# EAGLE board sweet sixteen v24_3 (EAGLE 7.2.0)
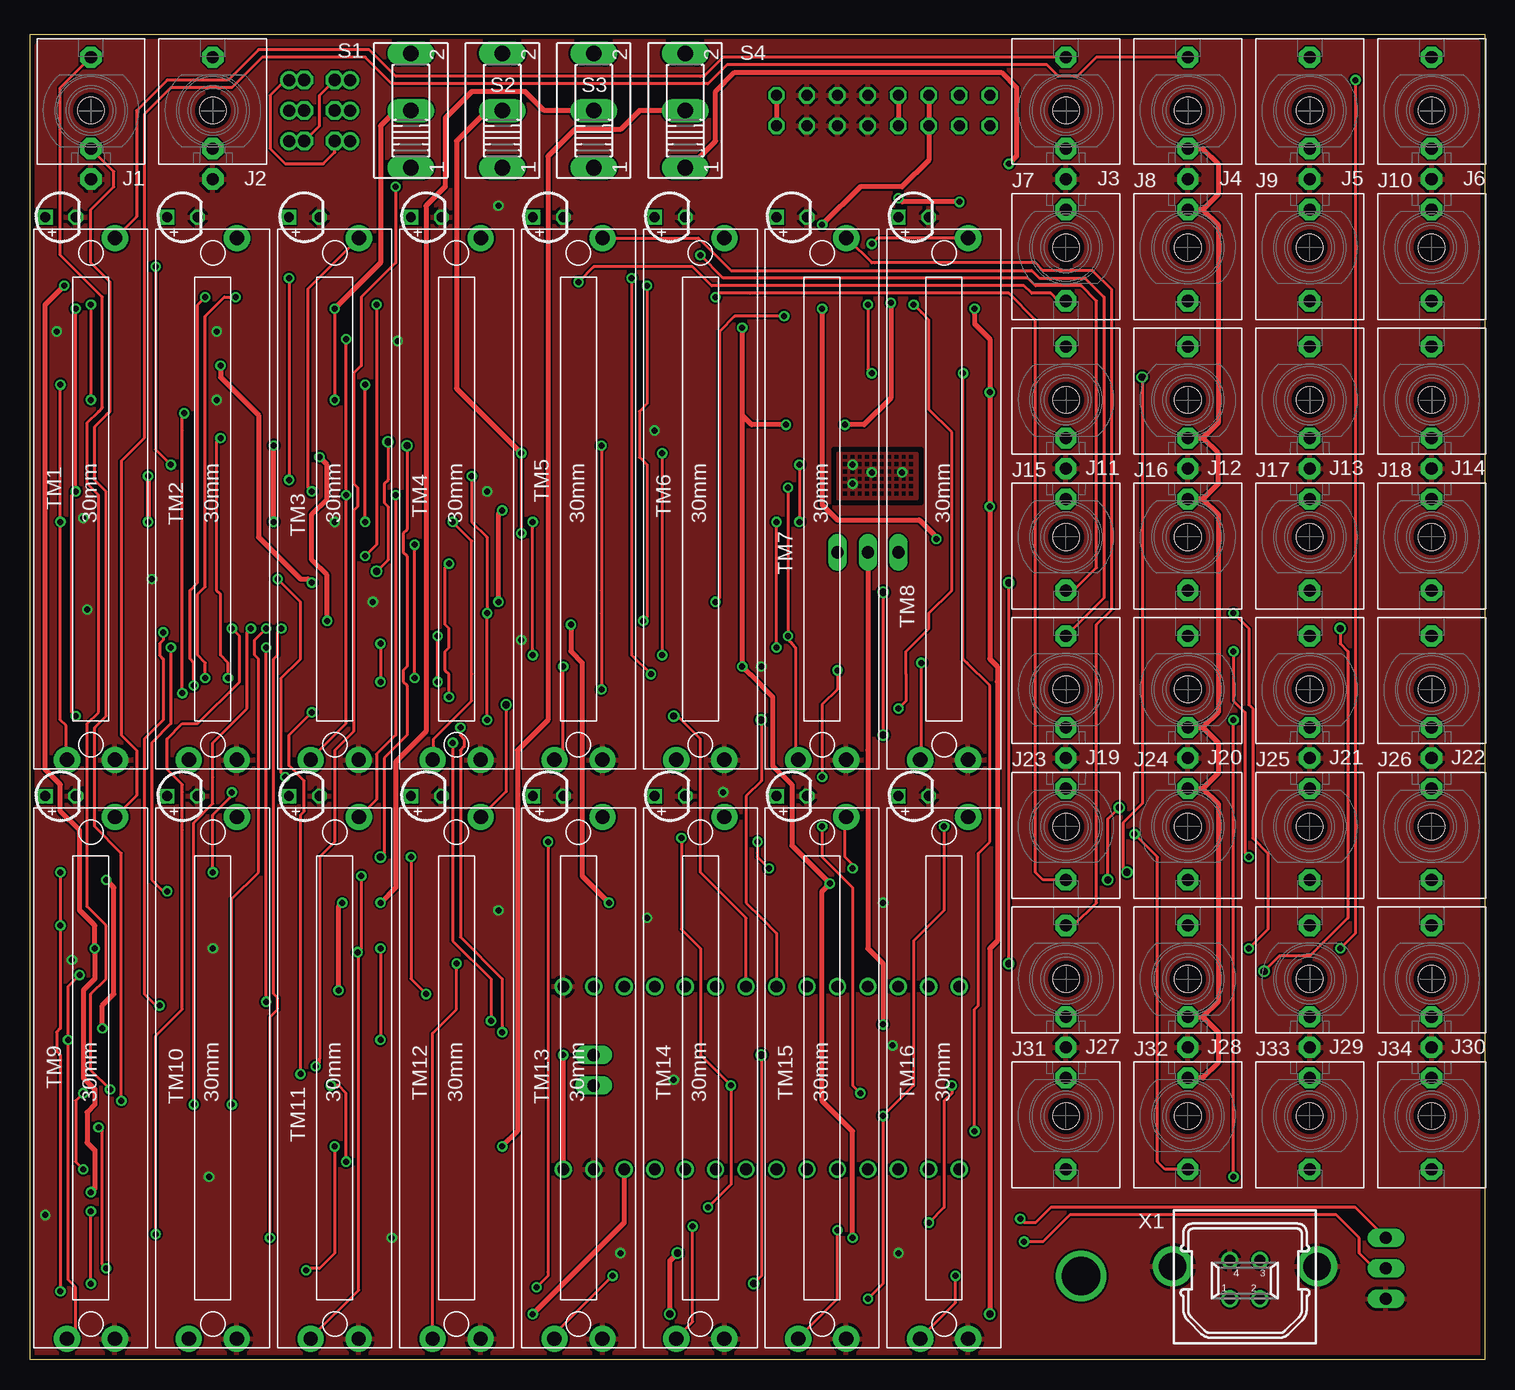
[diagram p3: board, top side]
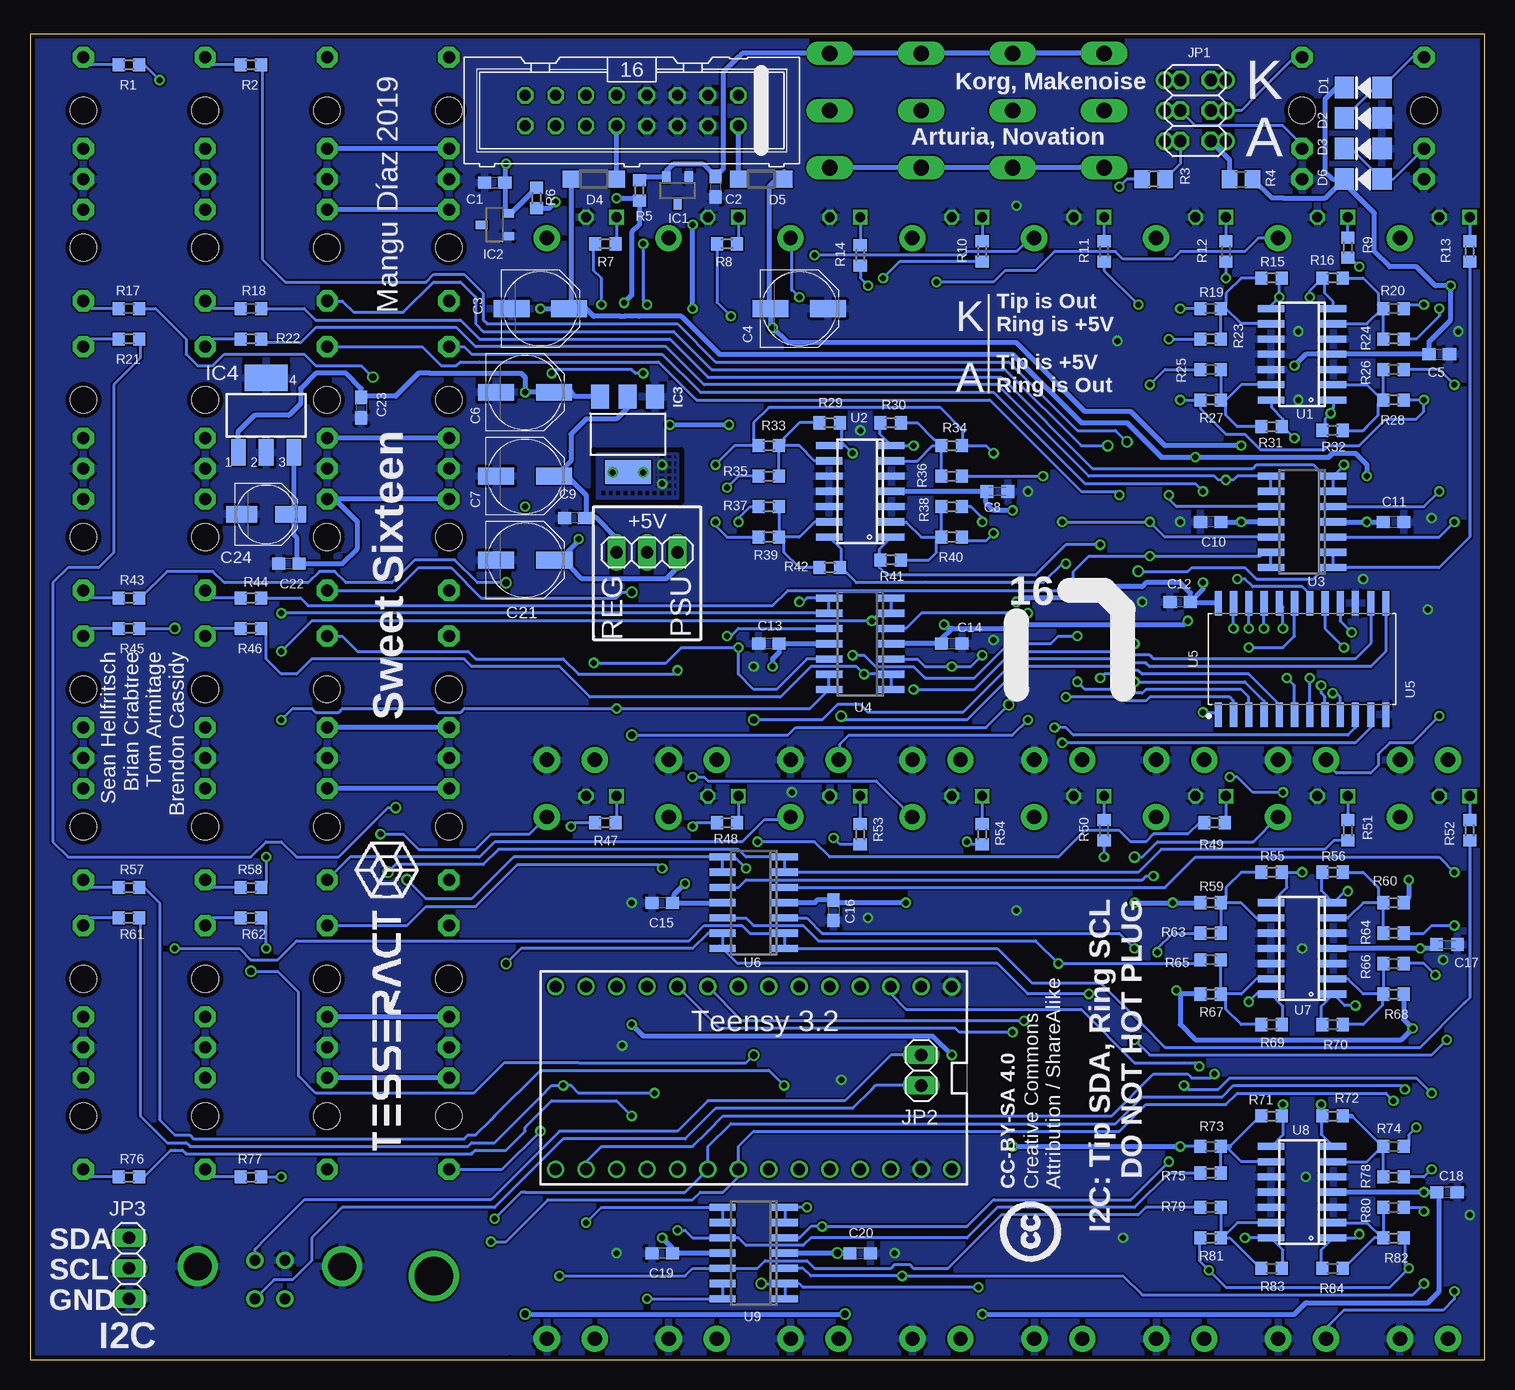
[diagram p4: board, bottom side, seen from below]

Size 121.28 x 110.49 mm. Coordinates in mm from the lower left corner, seen from the top.
Outline: 0,0 0,110.49
Outline: 0,110.49 121.28,110.49 121.28,0 81.28,0 0,0
Outline: 0,0 0,110.49
Copper layers (1*16): Top 0.0356mm / dielectric 1.5011mm / Bottom 0.0356mm
Design rules "oshpark-2layer *": minimum track width 6mil, minimum drill 13mil, track to track 6mil, track to pad 6mil, pad to pad 6mil, via to via 6mil, smd to smd 6mil, copper to edge 15mil, drill to drill 6mil, minimum pad ring 7mil, minimum via ring 7mil, stop-mask expansion 2.5mil, vias tented up to drill 25mil, thermal gap 10mil
tRestrict: 4 lines
bRestrict: 4 lines

## Footprints (pad centres in the part's own frame; a part is rotated, then mirrored left to right if it is on the bottom)
1X03 = drill 1.016 long: 1 -2.54,0; 2 0,0; 3 2.54,0
C0603 = smd 1.1 x 1: 1 -0.85,0; 2 0.85,0
PANASONIC_D = smd 3 x 1.4: + 2.4,0; - -2.4,0
C0603K = smd 1.05 x 1.08: 1 -0.875,0; 2 0.875,0
PANASONIC_C = smd 2.6 x 1.4: + 2.05,0; - -2.05,0
SOD-123 = smd 1.6 x 1.8: A 1.575,0; C -1.575,0
SOD123 = smd 1.4 x 1.4: A 1.9,0; C -1.9,0
DBZ_R-PDSO-G3 = smd 0.7 x 1: 1 -0.95,-1.1; 2 0.95,-1.1; 3 0,1.1
SOT223 = smd 1.499 x 2.007: 1 -2.261,-3.15; 2 0.025,-3.15; 3 2.311,-3.15 | smd 3.81 x 2.007: 4 0,3.15
SOT223' = smd 1.219 x 2.235: 1 -2.311,-3.099; 2 0,-3.099; 3 2.311,-3.099 | smd 3.6 x 2.2: 4 0,3.099
WQP_PJ_301M6 = drill 1.016 pad 1.778 octagon: P1 0,-5.715; P2 0,-3.175; P3 0,4.445 | hole 2.2: 0,0
2X03 = drill 1.016 octagon: 1 -2.54,-1.27; 2 -2.54,1.27; 3 0,-1.27; 4 0,1.27; 5 2.54,-1.27; 6 2.54,1.27
1X02 = drill 1.016 long: 1 -1.27,0; 2 1.27,0
LED3MM = drill 0.813 square: A -1.27,0 | drill 0.813 octagon: K 1.27,0
R0603 = smd 1 x 1.1: 1 -0.85,0; 2 0.85,0
R0805 = smd 1.3 x 1.5: 1 -0.95,0; 2 0.95,0
255SB_MANGU = drill 1.3 long: 1 -4.763,0; 2 0,0; 3 4.763,0
ML16 = drill 0.914 octagon: 1 -8.89,-1.27; 2 -8.89,1.27; 3 -6.35,-1.27; 4 -6.35,1.27; 5 -3.81,-1.27; 6 -3.81,1.27; 7 -1.27,-1.27; 8 -1.27,1.27; 9 1.27,-1.27; 10 1.27,1.27; 11 3.81,-1.27; 12 3.81,1.27; 13 6.35,-1.27; 14 6.35,1.27; 15 8.89,-1.27; 16 8.89,1.27
TEENSY_3.0-3.2&LC_DIL = drill 0.965: 0 -7.62,13.97; 1 -7.62,11.43; 2 -7.62,8.89; 3 -7.62,6.35; 3.3V 7.62,11.43; 4 -7.62,3.81; 5 -7.62,1.27; 6 -7.62,-1.27; 7 -7.62,-3.81; 8 -7.62,-6.35; 9 -7.62,-8.89; 10 -7.62,-11.43; 11 -7.62,-13.97; 12 -7.62,-16.51; 13 7.62,-16.51; 14/A0 7.62,-13.97; 15/A1 7.62,-11.43; 16/A2 7.62,-8.89; 17/A3 7.62,-6.35; 18/A4 7.62,-3.81; 19/A5 7.62,-1.27; 20/A6 7.62,1.27; 21/A7 7.62,3.81; 22/A8 7.62,6.35; 23/A9 7.62,8.89; AGND 7.62,13.97; GND -7.62,16.51; VIN 7.62,16.51
SLIDEPOT-45 = drill 1.2 pad 2.184: A -21.75,-2; B 21.75,-2.01; WIPER -21.75,2
SO14 = smd 0.6 x 2.2: 1 -3.81,-2.6; 2 -2.54,-2.6; 3 -1.27,-2.6; 4 0,-2.6; 5 1.27,-2.6; 6 2.54,-2.6; 7 3.81,-2.6; 8 3.81,2.6; 9 2.54,2.6; 10 1.27,2.6; 11 0,2.6; 12 -1.27,2.6; 13 -2.54,2.6; 14 -3.81,2.6
SOIC127P1030X265-24 = smd 2.056 x 0.602: 1 -4.642,6.985; 2 -4.642,5.715; 3 -4.642,4.445; 4 -4.642,3.175; 5 -4.642,1.905; 6 -4.642,0.635; 7 -4.642,-0.635; 8 -4.642,-1.905; 9 -4.642,-3.175; 10 -4.642,-4.445; 11 -4.642,-5.715; 12 -4.642,-6.985; 13 4.642,-6.985; 14 4.642,-5.715; 15 4.642,-4.445; 16 4.642,-3.175; 17 4.642,-1.905; 18 4.642,-0.635; 19 4.642,0.635; 20 4.642,1.905; 21 4.642,3.175; 22 4.642,4.445; 23 4.642,5.715; 24 4.642,6.985
KUSBVX-BS1N = drill 0.9 pad 1.422: 1 1.25,2.7; 2 -1.25,2.7; 3 -1.25,-0.5; 4 1.25,-0.5 | drill 2.3 pad 2.7: M1 -6.02,0; M2 6.02,0

## Placement (x,y rotation side)
+5V  [1X03]  69.85,67.31 0 bottom
C1  470n  [C0603]  82.55,98.11 180 bottom
C2  470n  [C0603]  64.14,97.79 270 bottom
C3  47u  [PANASONIC_D]  78.74,87.63 0 bottom
C4  47u  [PANASONIC_D]  57.15,87.63 0 bottom
C5  100n  [C0603]  3.81,83.82 0 bottom
C6  22u  [PANASONIC_D]  80.01,80.64 0 bottom
C7  22u  [PANASONIC_D]  80.01,73.66 0 bottom
C8  100n  [C0603K]  40.64,72.39 0 bottom
C9  100n  [C0603]  75.88,70.17 180 bottom
C10  100n  [C0603]  22.86,69.85 180 bottom
C11  100n  [C0603]  7.62,69.85 0 bottom
C12  100n  [C0603]  25.4,63.18 180 bottom
C13  100n  [C0603]  59.69,59.69 180 bottom
C14  100n  [C0603]  44.45,59.69 0 bottom
C15  100n  [C0603]  68.58,38.1 180 bottom
C16  100n  [C0603]  54.29,37.47 270 bottom
C17  100n  [C0603K]  3.17,34.61 0 bottom
C18  100n  [C0603]  3.17,13.97 0 bottom
C19  100n  [C0603]  68.58,8.89 180 bottom
C20  100n  [C0603]  52.07,8.89 0 bottom
C21  22u  [PANASONIC_D]  80.01,66.67 0 bottom
C22  100n  [C0603]  99.69,66.36 180 bottom
C23  330n  [C0603]  93.66,79.38 270 bottom
C24  10u  [PANASONIC_C]  101.6,70.48 0 bottom
D1  [SOD-123]  10.16,106.05 0 bottom
D2  [SOD-123]  10.16,103.5 0 bottom
D3  [SOD-123]  10.16,100.97 0 bottom
D4  1N5819HW  [SOD123]  74.3,98.42 0 bottom
D5  1N5819HW  [SOD123]  60.33,98.42 0 bottom
D6  [SOD-123]  10.16,98.42 0 bottom
IC1  LM4040C25  [DBZ_R-PDSO-G3]  67.31,97.47 180 bottom
IC2  LM4040c50  [DBZ_R-PDSO-G3]  82.55,94.61 90 bottom
IC3  LM1117-5  [SOT223]  71.44,77.15 180 bottom
IC4  UA78M08DCY  [SOT223']  101.6,78.74 0 bottom
J1  PJ301_THONKICONN6  [WQP_PJ_301M6]  5.08,104.14 0 top
J2  PJ301_THONKICONN6  [WQP_PJ_301M6]  15.24,104.14 0 top
J3  PJ301_THONKICONN6  [WQP_PJ_301M6]  86.36,104.14 0 top
J4  PJ301_THONKICONN6  [WQP_PJ_301M6]  96.52,104.14 0 top
J5  PJ301_THONKICONN6  [WQP_PJ_301M6]  106.68,104.14 0 top
J6  PJ301_THONKICONN6  [WQP_PJ_301M6]  116.84,104.14 0 top
J7  PJ301_THONKICONN6  [WQP_PJ_301M6]  86.36,92.71 180 top
J8  PJ301_THONKICONN6  [WQP_PJ_301M6]  96.52,92.71 180 top
J9  PJ301_THONKICONN6  [WQP_PJ_301M6]  106.68,92.71 180 top
J10  PJ301_THONKICONN6  [WQP_PJ_301M6]  116.84,92.71 180 top
J11  PJ301_THONKICONN6  [WQP_PJ_301M6]  86.36,80.01 0 top
J12  PJ301_THONKICONN6  [WQP_PJ_301M6]  96.52,80.01 0 top
J13  PJ301_THONKICONN6  [WQP_PJ_301M6]  106.68,80.01 0 top
J14  PJ301_THONKICONN6  [WQP_PJ_301M6]  116.84,80.01 0 top
J15  PJ301_THONKICONN6  [WQP_PJ_301M6]  86.36,68.58 180 top
J16  PJ301_THONKICONN6  [WQP_PJ_301M6]  96.52,68.58 180 top
J17  PJ301_THONKICONN6  [WQP_PJ_301M6]  106.68,68.58 180 top
J18  PJ301_THONKICONN6  [WQP_PJ_301M6]  116.84,68.58 180 top
J19  PJ301_THONKICONN6  [WQP_PJ_301M6]  86.36,55.88 0 top
J20  PJ301_THONKICONN6  [WQP_PJ_301M6]  96.52,55.88 0 top
J21  PJ301_THONKICONN6  [WQP_PJ_301M6]  106.68,55.88 0 top
J22  PJ301_THONKICONN6  [WQP_PJ_301M6]  116.84,55.88 0 top
J23  PJ301_THONKICONN6  [WQP_PJ_301M6]  86.36,44.45 180 top
J24  PJ301_THONKICONN6  [WQP_PJ_301M6]  96.52,44.45 180 top
J25  PJ301_THONKICONN6  [WQP_PJ_301M6]  106.68,44.45 180 top
J26  PJ301_THONKICONN6  [WQP_PJ_301M6]  116.84,44.45 180 top
J27  PJ301_THONKICONN6  [WQP_PJ_301M6]  86.36,31.75 0 top
J28  PJ301_THONKICONN6  [WQP_PJ_301M6]  96.52,31.75 0 top
J29  PJ301_THONKICONN6  [WQP_PJ_301M6]  106.68,31.75 0 top
J30  PJ301_THONKICONN6  [WQP_PJ_301M6]  116.84,31.75 0 top
J31  PJ301_THONKICONN6  [WQP_PJ_301M6]  86.36,20.32 180 top
J32  PJ301_THONKICONN6  [WQP_PJ_301M6]  96.52,20.32 180 top
J33  PJ301_THONKICONN6  [WQP_PJ_301M6]  106.68,20.32 180 top
J34  PJ301_THONKICONN6  [WQP_PJ_301M6]  116.84,20.32 180 top
JP1  [2X03]  24.13,104.14 90 bottom
JP2  [1X02]  46.99,24.13 90 bottom
JP3  [1X03]  113.03,7.62 90 bottom
LED1  [LED3MM]  2.54,95.25 0 top
LED2  [LED3MM]  12.7,95.25 0 top
LED3  [LED3MM]  22.86,95.25 0 top
LED4  [LED3MM]  33.02,95.25 0 top
LED5  [LED3MM]  43.18,95.25 0 top
LED6  [LED3MM]  53.34,95.25 0 top
LED7  [LED3MM]  63.5,95.25 0 top
LED8  [LED3MM]  73.66,95.25 0 top
LED9  [LED3MM]  2.54,46.99 0 top
LED10  [LED3MM]  12.7,46.99 0 top
LED11  [LED3MM]  22.86,46.99 0 top
LED12  [LED3MM]  33.02,46.99 0 top
LED13  [LED3MM]  43.18,46.99 0 top
LED14  [LED3MM]  53.34,46.99 0 top
LED15  [LED3MM]  63.5,46.99 0 top
LED16  [LED3MM]  73.66,46.99 0 top
R1  1K  [R0603]  113.03,107.95 180 bottom
R2  1K  [R0603]  102.87,107.95 180 bottom
R3  47  [R0805]  27.62,98.42 180 bottom
R4  47  [R0805]  20.32,98.42 0 bottom
R5  270  [R0603]  70.48,97.47 90 bottom
R6  270  [R0603]  79.06,96.84 90 bottom
R7  10k  [R0603]  73.34,93.03 0 bottom
R8  10k  [R0603]  63.18,93.03 0 bottom
R9  10k  [R0603]  11.43,92.71 90 bottom
R10  10k  [R0603]  41.91,92.39 90 bottom
R11  10k  [R0603]  31.75,92.39 90 bottom
R12  10k  [R0603]  21.59,92.39 90 bottom
R13  10k  [R0603]  1.27,92.39 90 bottom
R14  10k  [R0603]  52.07,92.08 90 bottom
R15  33k  [R0603]  17.78,90.17 0 bottom
R16  33k  [R0603]  12.7,90.17 180 bottom
R17  1K  [R0603]  113.03,87.63 180 bottom
R18  1K  [R0603]  102.87,87.63 180 bottom
R19  49.9k  [R0603]  22.86,87.63 0 bottom
R20  49.9k  [R0603]  7.62,87.63 180 bottom
R21  1K  [R0603]  113.03,85.09 180 bottom
R22  1K  [R0603]  102.87,85.09 180 bottom
R23  80.6k  [R0603]  22.86,85.09 0 bottom
R24  80.6k  [R0603]  7.62,85.09 180 bottom
R25  80.6k  [R0603]  22.86,82.55 0 bottom
R26  80.6K  [R0603]  7.62,82.55 180 bottom
R27  49.9k  [R0603]  22.86,80.01 0 bottom
R28  49.9k  [R0603]  7.62,80.01 180 bottom
R29  33k  [R0603]  54.61,78.11 0 bottom
R30  33k  [R0603]  49.53,78.11 180 bottom
R31  33k  [R0603]  17.78,77.79 0 bottom
R32  33k  [R0603]  12.7,77.47 180 bottom
R33  49.9k  [R0603]  59.69,76.2 0 bottom
R34  49.9k  [R0603]  44.45,76.2 180 bottom
R35  80.6k  [R0603]  59.69,73.66 0 bottom
R36  80.6k  [R0603]  44.45,73.66 180 bottom
R37  80.6k  [R0603]  59.69,71.12 0 bottom
R38  80.6k  [R0603]  44.45,71.12 180 bottom
R39  49.9k  [R0603]  59.69,68.58 0 bottom
R40  49.9k  [R0603]  44.45,68.58 180 bottom
R41  33k  [R0603]  49.53,66.67 180 bottom
R42  33k  [R0603]  54.61,66.04 0 bottom
R43  1K  [R0603]  113.03,63.5 180 bottom
R44  1K  [R0603]  102.87,63.5 180 bottom
R45  1K  [R0603]  113.03,60.96 180 bottom
R46  1K  [R0603]  102.87,60.96 180 bottom
R47  10k  [R0603]  73.34,44.77 0 bottom
R48  10k  [R0603]  63.18,44.77 0 bottom
R49  10k  [R0603]  22.54,44.77 0 bottom
R50  10k  [R0603]  31.75,44.13 90 bottom
R51  10k  [R0603]  11.43,44.13 90 bottom
R52  10k  [R0603]  1.27,44.13 90 bottom
R53  10k  [R0603]  52.07,43.81 90 bottom
R54  10k  [R0603]  41.91,43.81 90 bottom
R55  33k  [R0603]  17.78,40.64 0 bottom
R56  33k  [R0603]  12.7,40.64 180 bottom
R57  1K  [R0603]  113.03,39.37 180 bottom
R58  1K  [R0603]  102.87,39.37 180 bottom
R59  49.9k  [R0603]  22.86,38.1 0 bottom
R60  49.9k  [R0603]  7.62,38.1 180 bottom
R61  1K  [R0603]  113.03,36.83 180 bottom
R62  1K  [R0603]  102.87,36.83 180 bottom
R63  80.6k  [R0603]  22.86,35.56 0 bottom
R64  80.6k  [R0603]  7.62,35.56 180 bottom
R65  80.6k  [R0603]  22.86,33.34 0 bottom
R66  80.6k  [R0603]  7.62,33.02 180 bottom
R67  49.9k  [R0603]  22.86,30.48 0 bottom
R68  49.9k  [R0603]  7.62,30.48 180 bottom
R69  33k  [R0603]  17.78,27.94 0 bottom
R70  33k  [R0603]  12.7,27.94 180 bottom
R71  33k  [R0603]  17.78,20.32 0 bottom
R72  33k  [R0603]  12.7,20.32 180 bottom
R73  49.9k  [R0603]  22.86,17.78 0 bottom
R74  49.9k  [R0603]  7.62,17.78 180 bottom
R75  80.6k  [R0603]  22.86,15.56 0 bottom
R76  1K  [R0603]  113.03,15.24 180 bottom
R77  1K  [R0603]  102.87,15.24 180 bottom
R78  80.6k  [R0603]  7.62,15.24 180 bottom
R79  80.6k  [R0603]  22.86,12.7 0 bottom
R80  80.6k  [R0603]  7.62,12.7 180 bottom
R81  49.9k  [R0603]  22.86,10.16 0 bottom
R82  49.9k  [R0603]  7.62,10.16 180 bottom
R83  33k  [R0603]  17.78,7.62 0 bottom
R84  33k  [R0603]  12.7,7.62 180 bottom
S1  [255SB_MANGU]  31.75,104.14 90 top
S2  [255SB_MANGU]  39.37,104.14 90 top
S3  [255SB_MANGU]  46.99,104.14 90 top
S4  [255SB_MANGU]  54.61,104.14 90 top
SV1  [ML16]  71.12,104.14 180 bottom
TENSY3.2  TEENSY_3.1-3.2_DIL  [TEENSY_3.0-3.2&LC_DIL]  60.96,23.5 270 bottom
TM1  [SLIDEPOT-45]  5.08,71.75 90 top
TM2  [SLIDEPOT-45]  15.24,71.75 90 top
TM3  [SLIDEPOT-45]  25.4,71.75 90 top
TM4  [SLIDEPOT-45]  35.56,71.75 90 top
TM5  [SLIDEPOT-45]  45.72,71.75 90 top
TM6  [SLIDEPOT-45]  55.88,71.75 90 top
TM7  [SLIDEPOT-45]  66.04,71.75 90 top
TM8  [SLIDEPOT-45]  76.2,71.75 90 top
TM9  [SLIDEPOT-45]  5.08,23.5 90 top
TM10  [SLIDEPOT-45]  15.24,23.5 90 top
TM11  [SLIDEPOT-45]  25.4,23.5 90 top
TM12  [SLIDEPOT-45]  35.56,23.5 90 top
TM13  [SLIDEPOT-45]  45.72,23.5 90 top
TM14  [SLIDEPOT-45]  55.88,23.5 90 top
TM15  [SLIDEPOT-45]  66.04,23.5 90 top
TM16  [SLIDEPOT-45]  76.2,23.5 90 top
U1  MCP6004_SMD  [SO14]  15.24,83.82 90 bottom
U2  MCP6004_SMD  [SO14]  52.07,72.39 90 bottom
U3  TL074_SMD  [SO14]  15.24,69.85 90 bottom
U4  TL074_SMD  [SO14]  52.07,59.69 90 bottom
U5  CD74HC4067SM96  [SOIC127P1030X265-24]  15.24,58.42 90 bottom
U6  TL074_SMD  [SO14]  60.96,38.1 90 bottom
U7  MCP6004_SMD  [SO14]  15.24,34.29 90 bottom
U8  MCP6004_SMD  [SO14]  15.24,13.97 90 bottom
U9  TL074_SMD  [SO14]  60.96,8.89 90 bottom
U$1  [LOGO]  88.9,43.18 270 top
X1  KUSBVX-BS1N  [KUSBVX-BS1N]  101.28,7.78 180 top

## Tracks (layer width: path | path; a pad name or v marks a point on that pad's centre or on a via)
+
  Bottom 0.254: X1.3 102.53,9.23 101.6,10.16 98.42,13.34 82.87,13.34 77.15,19.05 67.31,19.05 64.77,21.59 53.34,21.59 49.85,25.08 49.53,25.4 JP2.2
+3V3  (via drill 0.5)
  Top 0.406: v5.08,13.97 5.4,14.29 5.4,17.46 4.76,18.1 4.76,20.64 5.4,21.27 5.4,22.54 4.45,23.5 4.45,30.8 5.4,31.75 v5.4,34.29 5.4,36.2 4.13,37.47 4.13,44.13 2.54,45.72 2.54,47.94 1.27,49.21 1.27,87.95 v2.86,89.53 | TENSY3.2.3.3V 49.53,11.43 v41.91,3.81 | v39.05,63.18 39.05,70.48 v39.37,70.8 | v15.88,82.87 15.88,81.92 19.05,78.74 19.05,68.58 22.54,65.09 23.18,65.09 v23.5,64.77
  Bottom 0.254: 12.38,106.05 D1.C
  Bottom 0.406: U2.4 C8.1 41.59,72.31 41.59,71.44 40.96,70.8 v39.37,70.8 | U8.4 v5.08,13.97 C18.1 3.81,13.76 3.81,5.71 4.76,4.76 14.92,4.76 15.88,3.81 v41.91,3.81 | U7.4 v5.4,34.29 4.45,34.29 4.13,34.61 C17.1 | U5.24 24.43,63.06 C12.1 | C12.1 24.55,63.92 25.4,64.77 28.26,64.77 28.57,64.45 33.97,64.45 34.92,63.5 38.73,63.5 v39.05,63.18 | 12.38,106.05 13.34,105.09 13.34,99.06 12.7,98.42 D6.C | D6.C 13.32,96.84 16.83,96.84 17.78,96.84 R4.2 | D6.C 11.43,98.12 11.43,97.79 10.48,96.84 9.21,95.57 9.21,92.39 7.94,91.12 5.71,91.12 4.13,89.53 v2.86,89.53 2.86,86.68 3.49,86.04 4.45,85.09 4.66,84.88 4.66,84.24 C5.1 U1.4 14.92,83.82 v15.88,82.87 | v23.5,64.77 23.5,64.24 C12.1
+5V  (via drill 0.5)
  Top 0.406: v71.12,27.94 71.12,33.02 69.85,34.29 69.85,50.8 +5V.2 | v44.45,25.4 TENSY3.2.VIN
  Bottom 0.406: v71.12,27.94 70.17,26.99 46.04,26.99 v44.45,25.4
+5V_A
  Bottom 0.406: IC3.2 71.46,79.35 72.39,78.42 74.93,78.42 76.2,77.15 76.2,75.74 76.2,74.93 77.47,73.66 C7.+ 76.52,73.66 74.93,72.07 74.93,71.44 74.93,70.27 | +5V.1 72.39,68.48 74.18,70.27 74.93,70.27 | 74.93,70.27 C9.1
+8V
  Top 0.406: J4.P2 97.79,100.97 99.06,99.69 99.06,97.16 97.79,95.89 | 97.79,95.89 J8.P2 97.79,95.89 | 97.79,95.89 99.06,94.61 99.06,78.11 97.79,76.83 | 97.79,76.83 J12.P2 97.79,76.83 | 97.79,71.75 99.06,73.03 99.06,75.56 97.79,76.83 | 97.79,71.75 J16.P2 97.79,71.75 | 97.79,71.75 99.06,70.48 99.06,53.98 97.79,52.7 | 97.79,52.7 J20.P2 97.79,52.7 | 97.79,52.7 99.06,51.44 99.06,48.9 97.79,47.62 | 97.79,47.62 99.06,46.35 99.06,29.84 97.79,28.57 | 97.79,28.57 99.06,27.3 99.06,24.77 97.79,23.5 J32.P2 | J28.P2 97.79,28.57 | J24.P2 97.79,47.62
  Bottom 0.406: J31.P2 J32.P2 | J27.P2 J28.P2 | J23.P2 J24.P2 | J19.P2 J20.P2 | J15.P2 95.89,71.75 | 95.89,71.75 J16.P2 | J11.P2 J12.P2 | J3.P2 J4.P2 | J7.P2 J8.P2 | 99.29,70.75 C24.+ 99.29,70.75 | 95.89,71.75 93.98,69.85 93.98,67.63 95.25,66.36 C22.1 99.06,66.57 99.06,68.58 99.29,68.81 99.29,70.75 | IC4.3 99.29,70.75
-
  Bottom 0.254: X1.2 100.94,6.67 99.38,6.67 97.79,8.26 97.79,10.16 95.25,12.7 82.55,12.7 76.83,18.41 66.67,18.41 64.14,20.95 52.7,20.95 51.12,22.54 50.8,22.86 JP2.1
A0  (via drill 0.5)
  Top 0.254: v12.7,55.56 12.7,77.47 12.7,79.06 v12.86,78.9
  Bottom 0.254: U1.1 12.64,79.44 v12.86,78.9 13.34,78.42 13.34,77.78 R32.2 13.65,77.47 | U5.9 12.06,55.24 12.38,55.56 v12.7,55.56
A1  (via drill 0.5)
  Top 0.254: v13.65,56.2 13.65,58.1 13.34,58.42 13.34,64.14 13.97,64.77 13.97,86.04 13.97,87.95 v14.61,88.58
  Bottom 0.254: U1.7 12.64,88.2 13.34,88.9 13.34,89.86 R16.2 14.61,89.11 v14.61,88.58 | U5.8 13.34,55.24 13.65,55.56 v13.65,56.2
A2  (via drill 0.5)
  Top 0.254: v14.61,56.83 14.61,58.1 13.97,58.74 13.97,63.82 14.61,64.45 14.61,87 15.24,87.63 16.19,88.58 16.83,88.58 v17.14,88.58
  Bottom 0.254: U1.8 17.84,87.89 v17.14,88.58 17.14,89.86 R15.2 | U5.7 v14.61,56.83
A3  (via drill 0.5)
  Top 0.254: v16.51,56.83 16.51,58.1 15.88,58.74 15.88,63.82 15.56,64.14 15.56,74.61 15.56,76.52 v15.88,76.83
  Bottom 0.254: R31.2 16.83,77.79 | 16.83,77.79 16.83,78.42 17.78,79.38 17.78,79.95 U1.14 | 16.83,77.79 R31.2 | U5.6 15.88,56.2 v16.51,56.83 | v15.88,76.83 15.88,77.05 16.09,77.05 16.83,77.79 | 16.83,77.79 R31.2
A4  (via drill 0.5)
  Top 0.254: v32.07,56.83 v32.07,67.94
  Bottom 0.254: U2.1 50.48,67.57 50.48,67 50.48,66.99 R41.2 50.48,66.57 50.48,66.04 49.85,65.41 46.67,65.41 37.47,65.41 34.92,67.94 v32.07,67.94 | U5.5 17.14,54.61 19.68,57.15 28.57,57.15 28.89,57.47 29.53,57.47 29.84,57.15 31.75,57.15 v32.07,56.83
A5  (via drill 0.5)
  Top 0.254: v47.62,76.2 47.62,64.14 47.62,62.23 v47.62,55.88 | v29.21,59.69 v29.21,56.52
  Bottom 0.254: R30.2 50.48,78.42 50.48,77.21 U2.7 48.26,76.2 v47.62,76.2 | v47.62,55.88 42.55,55.88 39.37,59.05 30.8,59.05 30.16,59.69 v29.21,59.69 | v29.21,56.52 20,56.52 18.41,54.93 U5.4
A6  (via drill 0.5)
  Top 0.254: v33.97,56.52 v33.97,60.33 | v52.7,75.56 v52.7,58.74
  Bottom 0.254: R29.2 53.66,78.42 53.66,77.21 53.66,76.52 53.34,76.2 | U5.3 19.68,55.24 20.32,55.88 28.26,55.88 28.57,55.56 29.53,55.56 29.84,55.88 30.48,55.88 33.34,55.88 v33.97,56.52 | U2.8 53.34,76.2 | 53.34,76.2 v52.7,75.56 | v52.7,58.74 51.75,58.74 50.8,57.78 47.62,57.78 46.67,56.83 42.55,56.83 39.69,59.69 36.2,59.69 35.56,60.33 v33.97,60.33
A7  (via drill 0.5)
  Top 0.254: v34.92,55.24 34.92,57.15 34.61,57.47 34.61,59.05 34.92,59.37 34.92,60.96 34.61,61.28 34.61,66.04 v34.92,66.36
  Bottom 0.254: 53.66,66.04 R42.2 53.66,66.04 | 53.66,66.04 53.66,67.57 U2.14 | U5.2 20.95,54.93 21.27,55.24 27.94,55.24 28.26,54.93 29.84,54.93 30.16,55.24 v34.92,55.24 | v34.92,66.36 35.24,66.36 36.83,64.77 52.39,64.77 53.66,66.04
A8  (via drill 0.5)
  Top 0.254: v11.11,60.64 11.11,60.01 10.79,59.69 10.79,58.74 11.11,58.42 11.11,53.34 9.53,51.75 9.53,30.48 10.48,29.53 v10.79,29.53
  Bottom 0.254: R70.2 13.65,28.26 13.65,29.47 U7.1 11.69,29.53 v10.79,29.53 | U5.16 12.06,61.59 v11.11,60.64
A9  (via drill 0.5)
  Top 0.254: v11.75,59.37 11.75,53.02 10.16,51.44 10.16,40.01 11.11,39.05 v11.43,39.05
  Bottom 0.254: R56.2 13.97,40.64 13.65,40.64 13.65,39.11 U7.7 11.69,39.05 v11.43,39.05 | U5.17 13.34,60.96 v11.75,59.37
A10  (via drill 0.5)
  Top 0.254: v15.24,40.64 15.24,45.4 16.83,46.99 v16.83,47.31 | v21.27,48.58 20.95,48.9 20.95,56.83 22.54,58.42 22.54,63.18 v20.64,65.09
  Bottom 0.254: U7.8 17.78,38.1 16.51,39.37 16.51,40.32 R55.2 v15.24,40.64 | U5.18 14.61,63.82 15.24,64.45 19.37,64.45 20,65.09 v20.64,65.09 | v16.83,47.31 19.37,47.31 20.64,48.58 v21.27,48.58
A11  (via drill 0.5)
  Top 0.254: v19.68,29.84 v19.68,59.37
  Bottom 0.254: R69.2 16.83,28.26 16.83,29.47 U7.14 19.05,30.48 v19.68,29.84 | v19.68,59.37 16.83,59.37 15.88,60.33 U5.19
A12  (via drill 0.5)
  Top 0.254: v10.48,10.48 10.48,26.99 12.7,29.21 12.7,44.13 12.7,47.31 12.7,47.94 11.43,49.21 11.43,51.75 12.7,53.02 13.97,53.02 17.46,56.52 17.46,60.33 v16.83,60.96
  Bottom 0.254: R84.2 13.65,7.94 13.65,9.15 U8.1 10.79,10.16 v10.48,10.48 | v16.83,60.96 16.83,62.74 U5.20
A13  (via drill 0.5)
  Top 0.254: v13.65,21.27 13.65,44.77 15.24,46.35 15.24,48.58 15.24,49.21 15.24,51.44 18.1,54.29 18.1,60.64 v18.41,60.96
  Bottom 0.254: U8.7 13.65,18.79 13.65,20 R72.2 13.65,20.64 v13.65,21.27 | v18.41,60.96 U5.21
A14  (via drill 0.5)
  Top 0.254: v16.83,21.27 16.83,38.42 19.05,40.64 19.05,58.42 18.73,58.74 18.73,60.01 v19.68,60.96
  Bottom 0.254: U8.8 17.78,17.78 16.83,18.73 16.83,20 R71.2 16.93,20.54 16.83,20.64 v16.83,21.27 | v19.68,60.96 U5.22
A15  (via drill 0.5)
  Top 0.254: v20,10.16 20,28.57 20.64,29.21 20.64,30.16 20.32,30.48 20.32,58.42 20.64,58.74 20.64,60.64 v20.95,60.96
  Bottom 0.254: R83.2 16.83,7.62 16.83,9.15 U8.14 v20,10.16 | v20.95,60.96 U5.23
ANALOG_IN  (via drill 0.5)
  Top 0.254: v22.54,23.81 22.54,45.4 22.86,45.72 22.86,48.26 21.59,49.53 21.59,52.07 v23.5,53.98
  Bottom 0.254: TENSY3.2.14/A0 74.93,16.51 73.66,17.78 66.04,17.78 64.77,19.05 63.5,20.32 31.11,20.32 27.62,23.81 24.77,23.81 24.45,23.5 22.86,23.5 v22.54,23.81 | v23.5,53.98 22.42,53.98 U5.1
AREF_-2.5
  Bottom 0.406: S1.3 S2.3 S3.3 S4.3 61.91,108.9 62.23,108.58 62.17,108.65 63.5,107.31 63.5,99.28 C2.1 65.19,99.69 67.63,99.69 68.26,99.06 IC1.2 70.23,98.57 R5.2
AREF_-5  (via drill 0.5)
  Top 0.406: S4.1 55.18,99.63 57.15,101.6 57.15,105.73 58.74,107.31 80.96,107.31 82.23,106.05 82.23,100.33 v81.6,99.69 | v81.6,99.69 81.34,99.63 v81.6,99.69
  Bottom 0.406: S1.1 S2.1 S3.1 S4.1 | R6.2 81.18,95.56 IC2.2 81.7,95.81 C1.1 81.7,99.38 v81.6,99.69
BI_A  (via drill 0.5)
  Top 0.254: v5.08,87.95 v5.08,80.01 | v25.4,87.63 v25.4,80.01
  Top 0.406: S1.2 30.48,104.14 29.21,102.87 29.21,91.44 v25.4,87.63
  Bottom 0.254: 6.35,80.01 R28.1 v5.08,80.01 5.08,79.06 5.71,78.42 8.26,78.42 10.48,76.2 13.02,76.2 13.34,75.88 18.73,75.88 19.37,76.52 20,77.15 21.59,77.15 22.86,78.42 23.71,79.27 R27.1 v25.4,80.01 | R20.1 6.35,87.95 v5.08,87.95 | R19.1 v25.4,87.63
BI_B  (via drill 0.5)
  Top 0.254: v40.96,75.56 v40.96,68.9 | v64.14,74.61 v64.14,69.85
  Top 0.406: S2.2 38.1,104.14 35.56,101.6 35.56,80.96 v40.96,75.56
  Bottom 0.254: v40.96,75.56 41.59,76.2 R34.1 43.5,76.2 | v40.96,68.9 41.59,68.26 43.18,68.26 R40.1 | v64.14,74.61 62.55,76.2 R33.1 60.96,76.52 60.96,78.11 59.69,79.38 45.72,79.38 45.4,79.38 43.5,77.47 43.5,76.2 | v64.14,69.85 64.14,69.53 63.18,68.58 R39.1 | 43.5,76.2 | 43.5,76.2 | 43.5,76.2
BI_C  (via drill 0.5)
  Top 0.406: S3.2 42.86,104.14 41.27,105.73 36.83,105.73 34.61,103.5 34.61,97.79 33.02,96.2 33.02,52.39 30.48,49.85 30.48,39.37 v29.21,38.1 | v25.72,30.8 25.72,37.78 v26.04,38.1 | v6.03,27.62 6.03,29.53 6.99,30.48 6.99,39.37 v6.35,40.01
  Bottom 0.406: v29.21,38.1 v26.04,38.1 R59.1 | 25.4,30.48 v25.72,30.8 25.4,30.48 | R68.1 6.77,28.36 v6.03,27.62 6.99,26.67 24.13,26.67 25.4,27.94 25.4,30.48 | v6.35,40.01 6.35,38.52 R60.1 | R67.1 25.4,30.48
BI_D  (via drill 0.5)
  Top 0.254: v6.35,7.62 6.03,7.94 6.03,19.05 v5.71,19.37 | v25.4,17.78 25.4,8.89 24.13,7.62 23.18,7.62 v23.02,7.46
  Top 0.406: S4.2 50.8,104.14 49.21,102.55 45.4,102.55 43.18,100.33 43.18,53.34 40.64,50.8 40.64,19.05 v39.37,17.78
  Bottom 0.254: R82.1 6.67,9.84 6.67,7.94 v6.35,7.62 7.94,6.03 21.59,6.03 v23.02,7.46 23.81,8.25 23.81,10.16 R81.1 | v5.71,19.37 6.35,18.73 6.35,17.78 R74.1 | R73.1 v25.4,17.78
  Bottom 0.406: v39.37,17.78 v25.4,17.78
CV1
  Bottom 0.254: R2.2 106.05,107.95 J5.P3
CV2
  Bottom 0.254: R18.2 106.05,87.63 J9.P3
CV3
  Bottom 0.254: R22.2 106.05,85.09 J13.P3
CV4
  Bottom 0.254: R44.2 106.05,63.5 J17.P3
CV5
  Bottom 0.254: R46.2 106.05,60.96 J21.P3
CV6
  Bottom 0.254: R58.2 106.05,39.37 J25.P3
CV7
  Bottom 0.254: R62.2 106.05,36.83 J29.P3
CV8
  Bottom 0.254: R77.2 106.05,15.24 J33.P3
CV9
  Bottom 0.254: R1.2 116.2,107.95 J6.P3
CV10
  Bottom 0.254: R17.2 116.2,87.63 J10.P3
CV11
  Bottom 0.254: R21.2 116.2,85.09 J14.P3
CV12
  Bottom 0.254: R43.2 116.2,63.5 J18.P3
CV13
  Bottom 0.254: R45.2 116.2,60.96 J22.P3
CV14
  Bottom 0.254: R57.2 116.2,39.37 J26.P3
CV15
  Bottom 0.254: R61.2 116.2,36.83 J30.P3
CV16
  Bottom 0.254: R76.2 116.2,15.24 J34.P3
GND  (via drill 0.5)
  other vias: 71.12,38.1 51.44,36.83 57.78,47.31 1.27,12.06 14.92,15.24 60.96,57.78 40.96,60.01 49.21,8.89 72.39,8.89 15.24,34.29 3.49,33.34 4.45,70.17 15.56,85.72 2.22,85.72 15.56,80.01 10.16,65.09 28.57,63.18 25.4,69.85 38.1,72.39 52.07,77.47 4.76,62.55 39.05,96.2 30.64,84.93 39.05,37.47 71.91,26.19 30.16,10.16 53.66,23.34
  pour Bottom: 0,0 121.37,0 121.05,107.96 arc90 120.42,110.49 0,110.49 arc90 0,109.22
  pour Top: 0,-0.32 81.28,-0.32 81.28,0 121.28,0 121.28,107.95 arc90 119.38,110.49 2.54,110.49 arc90 0,107.95
MIDI_OUT  (via drill 0.5)
  Top 0.254: v30.48,97.79 30.48,91.44 27.62,88.58 27.62,82.87 26.99,82.23 26.99,73.03 27.3,72.71 27.3,71.12 26.99,70.8 26.99,52.39 25.4,50.8 25.4,43.18 24.13,41.91 24.13,25.08 24.13,24.77 v23.81,24.45
  Bottom 0.254: TENSY3.2.1 49.53,30.48 48.26,29.21 33.66,29.21 29.21,24.77 25.08,24.77 24.13,24.77 v23.81,24.45 | R3.2 29.84,98.42 v30.48,97.79
N$1  (via drill 1)
  Bottom 0.254: J2.P3 15.88,108.58 19.05,105.41 20.32,104.14 v21.59,104.14 JP1.3
N$2  (via drill 1)
  Bottom 0.254: J2.P2 15.56,101.6 16.83,102.87 24.13,102.87 JP1.4 v26.67,104.14
N$3  (via drill 1)
  Top 0.254: JP1.5 v21.59,106.68 21.27,106.68 20,105.41 20,100.97 21.27,99.69 24.45,99.69 25.4,100.65 JP1.2
  Bottom 0.254: R3.1 25.4,99.7 JP1.2 v26.67,101.6
N$4  (via drill 1)
  Top 0.254: JP1.1 24.13,102.87 24.13,105.41 JP1.6 v26.67,106.68
  Bottom 0.254: JP1.1 v21.59,101.6
  Bottom 0.406: R4.1 21.27,100.01 JP1.1
N$5  (via drill 0.5)
  Top 0.254: J32.P3 94.61,15.88 93.98,16.51 93.98,41.91 v92.08,43.81
  Bottom 0.254: v92.08,43.81 90.17,43.81 88.9,42.55 84.14,42.55 82.87,43.81 79.64,43.81 TM16.B
N$6
  Bottom 0.254: R23.2 R19.2 | R15.1 20.32,90.17 21.59,88.9 21.59,87.95 R19.2 | U1.9 20.32,86.36 21.59,87.63 R19.2
N$7
  Bottom 0.254: R25.2 R27.2 | R31.1 20.64,77.79 21.59,78.74 21.59,79.69 R27.2 | U1.13 20.32,81.28 21.59,80.01 R27.2
N$8  (via drill 0.5)
  Top 0.254: v68.58,40.96 68.9,40.96 67.94,41.91 67.94,45.14 TM15.B
  Bottom 0.254: J28.P3 89.85,36.2 88.27,37.78 84.14,37.78 80.64,41.27 68.9,41.27 v68.58,40.96
N$9
  Bottom 0.254: R28.2 R26.2 | U1.2 9.84,81.28 8.57,80.01 R28.2 | R32.1 10.16,77.47 9.84,77.79 8.89,78.74 8.89,79.69 R28.2
N$10
  Bottom 0.254: R24.2 R20.2 | U1.6 9.84,86.36 8.57,87.63 R20.2 | R16.1 10.16,90.17 8.89,88.9 8.89,87.95 R20.2
N$11
  Bottom 0.254: TM14.B 58.1,45.09 57.78,45.09 57.89,44.98 60.11,44.98 61.91,43.18 82.55,43.18 83.82,41.91 94.61,41.91 J24.P3
N$12
  Bottom 0.254: 45.72,71.12 R38.2 R40.2 | U2.2 48.26,69.85 46.99,68.58 R40.2 | R41.1 46.35,66.67 45.72,67.31 45.72,68.26 R40.2
N$13
  Bottom 0.254: R36.2 R34.2 | R30.1 47.31,78.11 46.04,76.83 45.72,76.52 R34.2 | U2.6 47.31,74.93 46.04,76.2 R34.2
N$14  (via drill 0.5)
  Top 0.254: v67.31,57.47 67.31,55.88 66.04,54.61 v66.04,48.58
  Bottom 0.254: J20.P3 95.25,60.33 93.98,59.05 84.77,59.05 84.14,58.42 76.83,58.42 75.56,57.15 67.63,57.15 v67.31,57.47 | v66.04,48.58 65.09,48.58 64.77,48.26 50.74,48.26 TM13.B
N$15
  Bottom 0.254: R35.2 R33.2 | R29.1 57.15,78.11 58.42,76.83 58.42,76.52 R33.2 | U2.9 55.88,74.93 57.15,76.2 R33.2
N$16
  Bottom 0.254: R39.2 R37.2 58.74,70.8 | U2.13 55.88,69.85 57.15,68.58 R39.2 | R42.1 57.15,66.04 58.42,67.31 58.42,68.26 R39.2
N$17  (via drill 0.6)
  Top 0.254: v71.12,63.98 71.12,53.34 v71.12,52.07 | v39.69,54.61 39.69,47.36 TM12.B
  Bottom 0.254: J16.P3 90.81,64.14 88.9,66.04 86.2,66.04 83.66,63.5 72.39,63.5 71.91,63.98 v71.12,63.98 | v71.12,52.07 58.1,52.07 57.47,52.7 41.59,52.7 v39.69,54.61
N$18
  Bottom 0.254: R80.2 R82.2 | R82.2 9.21,10.16 11.75,7.62 R84.1 | U8.2 9.84,11.43 8.57,10.16 R82.2
N$19
  Bottom 0.254: LED1.A R13.2
N$20  (via drill 0.5)
  Top 0.254: v30.48,72.07 30.48,52.07 28.89,50.48 28.89,46.73 TM11.B
  Bottom 0.254: J12.P3 88.58,84.45 87,82.87 85.72,82.87 85.41,83.19 83.82,83.19 68.9,83.19 65.72,80.01 41.27,80.01 33.66,72.39 30.8,72.39 v30.48,72.07
N$21
  Bottom 0.254: 21.27,17.78 18.73,20.32 R71.1 | R75.2 R73.2 | U8.9 20.32,16.51 21.59,17.78
  Bottom 0.406: 21.27,17.78 21.59,17.78 R73.2
N$22
  Bottom 0.254: R79.2 R81.2 | R81.2 21.27,10.16 18.73,7.62 R83.1 | U8.13 20.64,11.43 21.91,10.16 R81.2
N$23  (via drill 0.6)
  Top 0.254: v31.43,76.2 31.43,69.22 31.11,68.9 31.11,67.31 31.43,66.99 31.43,57.78 31.11,57.47 31.11,56.52 31.43,56.2 31.43,52.07 29.53,50.16 29.53,42.23 v29.21,41.91
  Bottom 0.254: J8.P3 95.25,88.27 94.3,87.31 90.17,87.31 87.63,89.85 85.41,89.85 84.14,88.58 84.14,86.36 83.5,85.72 67.63,85.72 64.45,82.55 40.01,82.55 33.66,76.2 v31.43,76.2 | v29.21,41.91 28.57,41.91 27.3,43.18 19.32,43.18 TM10.B
N$24
  Bottom 0.254: R68.2 8.57,30.48 8.57,29.53 10.16,27.94 R70.1 | R68.2 10.16,30.48 11.43,31.75 U7.2 | R66.2 R68.2
N$25
  Bottom 0.254: R9.2 LED2.A
N$26
  Top 0.254: J4.P3 88.9,108.58 87.31,107 85.72,107 84.77,107.95 58.1,107.95 56.52,106.36 56.2,106.36 30.16,106.36 27.94,108.58 25.08,108.58 19.37,108.58 16.83,106.05 11.75,106.05 9.53,103.82 9.53,76.83 7.62,74.93 7.62,52.07 8.89,50.8 8.89,47.05 TM9.B
N$27
  Bottom 0.254: R56.1 10.16,40.64 8.89,39.37 8.89,38.42 R60.2 | R60.2 10.16,38.1 11.43,36.83 U7.6 | R64.2 R60.2
N$28
  Bottom 0.254: R55.1 20.32,40.64 21.59,39.37 21.59,38.42 R59.2 | R59.2 R63.2 | U7.9 19.05,36.83 20.32,38.1 R59.2
N$29  (via drill 0.5)
  Top 0.254: v78.74,19.05 78.74,29.21 79.06,29.53 79.06,42.23 80.01,43.18 80.01,56.2 78.11,58.1 77.79,58.42 v77.79,82.23 | TM8.B 70.64,93.5 v70.17,93.03 | v69.85,87.95 69.85,82.55 v70.17,82.23
  Bottom 0.254: J31.P3 81.92,15.88 v78.74,19.05 | v70.17,93.03 70.17,88.27 v69.85,87.95 | v70.17,82.23 70.8,82.23 71.12,82.55 77.47,82.55 v77.79,82.23
N$30
  Top 0.254: J27.P3 87,36.2 88.9,38.1 88.9,61.28 90.17,62.55 90.17,62.87 90.17,89.22 88.58,90.81 84.45,90.81 83.82,91.44 70.43,91.44 70.17,91.44 68.26,93.34 TM7.B
N$31  (via drill 0.5)
  Top 0.254: J23.P3 84.45,40.01 83.82,40.64 83.82,86.68 81.6,88.9 80.96,88.9 60.64,88.9 60.01,88.9 57.47,88.9 v57.15,88.58
  Bottom 0.254: v57.15,88.58 57.73,89.17 57.78,89.17 57.78,93.34 TM6.B
N$32
  Top 0.254: TM5.B 55.72,93.5 58.42,90.81 83.5,90.81 84.14,90.17 87.95,90.17 89.53,88.58 89.53,63.5 J19.P3
N$33  (via drill 0.5)
  Top 0.254: J15.P3 87,64.14 88.9,66.04 88.9,88.27 87.63,89.53 83.82,89.53 83.19,90.17 57.78,90.17 v55.88,92.08
  Bottom 0.254: TM4.B 37.62,93.5 38.1,93.98 38.1,93.34 39.05,92.39 43.18,92.39 43.5,92.08 v55.88,92.08
N$34  (via drill 0.5)
  Top 0.254: v23.5,72.39 23.18,72.71 23.18,89.27 TM3.B
  Bottom 0.254: J11.P3 85.09,84.45 84.45,83.82 68.58,83.82 65.41,80.64 40.96,80.64 33.34,73.03 24.13,73.03 v23.5,72.39
N$35  (via drill 0.5)
  Top 0.254: J7.P3 85.72,88.27 85.09,88.9 83.5,88.9 82.87,89.53 56.83,89.53 55.24,91.12 46.99,91.12 v45.72,89.85
  Bottom 0.254: TM2.B 18.89,93.5 20,92.39 25.4,92.39 26.04,91.76 30.16,91.76 30.8,92.39 35.88,92.39 37.47,90.81 40.01,90.81 40.96,89.85 v45.72,89.85
N$36
  Top 0.254: J3.P3 57.78,108.58 56.2,107 55.88,107 30.48,107 28.26,109.22 25.4,109.22 19.05,109.22 16.51,106.68 11.43,106.68 8.89,104.14 8.89,95.31 TM1.B
N$37
  Bottom 0.254: R69.1 20.32,27.94 21.59,29.21 21.59,30.16 R67.2 | U7.13 19.05,31.75 20.32,30.48 R67.2 | R67.2 R65.2
N$38
  Bottom 0.254: LED3.A R12.2
N$39
  Bottom 0.254: LED4.A R11.2
N$40
  Bottom 0.254: LED8.A 72.39,93.13 R7.2
N$41  (via drill 0.5)
  Top 0.406: SV1.11 SV1.12 74.93,100.01 72.71,97.79 69.22,97.79 v66.04,94.61 | v66.04,87.63 66.04,72.39 66.04,71.28 67.31,70.01 74.14,70.01 75.56,68.58 v75.56,68.42
  Bottom 0.406: v66.04,87.63 v66.04,94.61 | v75.56,68.42 75.72,68.28 75.72,68.1 77.15,66.67 C21.+ 76.2,67.31 76.2,66.04 75.25,65.09 68.26,65.09 67.31,66.04 +5V.3
N$42
  Bottom 0.254: LED7.A 62.23,93.13 R8.2
N$43
  Bottom 0.254: LED6.A R14.2
N$44
  Bottom 0.254: LED5.A R10.2
N$45
  Bottom 0.254: LED9.A R52.2
N$46
  Bottom 0.254: LED10.A R51.2
N$47
  Bottom 0.254: LED11.A 21.59,44.87 R49.2
N$48
  Bottom 0.254: LED12.A R50.2
N$49
  Bottom 0.254: R54.2 LED13.A
N$50
  Bottom 0.254: R53.2 LED14.A
N$51
  Bottom 0.254: LED15.A 62.23,44.87 R48.2
N$52
  Bottom 0.254: 11.11,20.32 8.57,17.78 | 8.57,17.78 R74.2 | U8.6 9.84,16.51 8.57,17.78 | 8.57,17.78 R74.2 | R78.2 R74.2
  Bottom 0.406: R72.1 11.11,20.32
N$53
  Bottom 0.254: LED16.A 72.39,44.87 R47.2
N$54  (via drill 0.5)
  other vias: 70.17,73.98 72.71,73.98 68.58,73.03 68.58,74.61
  pour Top (hatched): 67.31,75.56 67.31,71.75 73.98,71.75 73.98,75.56
  pour Bottom (hatched): 67.31,75.56 67.31,71.75 73.98,71.75 73.98,75.56
N$56
  Top 0.406: SV1.9 SV1.10
  Bottom 0.406: D4.A SV1.10
N$64
  Top 0.406: SV1.1 SV1.2
  Bottom 0.406: D5.C SV1.2
N$300  (via drill 0.6)
  Top 0.254: v29.84,76.52 29.84,73.34 29.53,73.03 29.53,71.44 29.84,71.12 29.84,66.67 v28.89,65.72
  Bottom 0.254: U3.1 U3.2 | R2.1 101.92,107.95 101.92,91.76 100.01,89.85 88.27,89.85 87.63,90.49 85.09,90.49 83.5,88.9 83.5,86.68 83.19,86.36 67.31,86.36 64.14,83.19 39.69,83.19 33.97,77.47 30.8,77.47 v29.84,76.52 | v28.89,65.72 24.77,65.72 24.45,66.04 20,66.04 19.68,65.72 19.05,65.09 14.29,65.09 13.34,66.04 U3.1 | R13.1 1.27,68.58 3.81,66.04 11.43,66.04 U3.1
N$301  (via drill 0.5)
  Top 0.254: v10.48,91.12 10.48,75.88 v11.75,74.61
  Bottom 0.254: U3.6 U3.7 | R18.1 98.42,87.63 97.47,86.68 85.41,86.68 83.82,85.09 67.94,85.09 64.77,81.92 40.32,81.92 32.7,74.3 19.37,74.3 19.05,74.61 14.29,74.61 13.34,73.66 U3.7 | R9.1 11.21,91.86 v10.48,91.12 | v11.75,74.61 11.75,74.55 U3.7
N$302  (via drill 0.5)
  Top 0.254: v21.59,90.17 v21.59,73.34
  Bottom 0.254: U3.9 U3.8 20.64,73.66 20.95,73.34 v21.59,73.34 22.23,73.34 22.54,73.66 33.02,73.66 40.64,81.28 65.09,81.28 68.26,84.45 84.14,84.45 85.72,86.04 97.47,86.04 98.74,84.77 101.6,84.77 R22.1 | R12.1 v21.59,90.17
N$303  (via drill 0.5)
  Top 0.254: v28.89,87.95 28.89,67.94 v27.94,66.99
  Bottom 0.254: U3.14 U3.13 18.41,67.31 18.73,66.99 v27.94,66.99 32.7,66.99 33.02,66.99 34.29,65.72 34.29,65.09 35.24,64.14 57.47,64.14 58.1,64.14 59.37,62.87 97.79,62.87 98.11,62.87 98.74,63.5 R44.1 | R11.1 31.75,90.81 v28.89,87.95
N$304  (via drill 0.5)
  Top 0.254: v50.16,90.17 50.16,58.74 v51.75,57.15
  Bottom 0.254: U4.1 U4.2 v51.75,57.15 52.39,57.78 56.2,57.78 58.74,55.24 74.61,55.24 77.15,57.78 84.45,57.78 85.09,58.42 97.79,58.42 99.06,57.15 100.33,57.15 101.6,58.42 101.6,60.64 R46.1 | R10.1 48.79,91.54 v50.16,90.17
N$305  (via drill 0.5)
  Top 0.254: v100.33,59.05 100.33,54.93 101.28,53.98 101.28,42.23 v101.6,41.91 | v51.44,89.53 51.44,79.69 50.8,79.06 50.8,75.25 51.44,74.61 51.44,61.91 v51.12,61.59
  Bottom 0.254: U4.7 U4.6 50.48,62.23 v51.12,61.59 97.47,61.59 97.79,61.59 v100.33,59.05 | v101.6,41.91 101.6,39.69 R58.1 | R14.1 52.07,90.17 v51.44,89.53
N$306  (via drill 0.5)
  Top 0.254: v100.33,62.23 101.6,60.96 101.6,54.61 101.92,54.29 101.92,43.5 103.19,42.23 103.19,35.88 v101.6,34.29 | v62.87,87 58.74,87 57.47,85.72 57.47,63.82 57.47,63.5 v57.15,63.18
  Bottom 0.254: v100.33,62.23 U4.9 U4.8 56.2,63.5 56.52,63.5 56.83,63.18 v57.15,63.18 | v101.6,34.29 101.6,36.51 R62.1 | R8.1 64.03,88.16 v62.87,87
N$307  (via drill 0.5)
  Top 0.254: v100.33,15.24 v100.33,53.34 | v73.66,87.95 74.3,87.31 74.93,86.68 74.93,79.22 76.83,77.31 76.83,64.14 74.93,62.23 74.93,60.96 73.03,59.05 73.03,57.15 73.03,54.93 v72.39,54.29
  Bottom 0.254: U4.13 U4.14 56.26,54.29 v72.39,54.29 85.09,54.29 85.41,53.98 87.31,53.98 87.63,54.29 95.25,54.29 95.57,53.98 97.47,53.98 97.79,54.29 99.38,54.29 v100.33,53.34 | R77.1 v100.33,15.24 | v73.66,87.95 73.66,90.17 74.3,90.81 74.3,92.92 R7.1
N$308  (via drill 0.5)
  Top 0.254: v110.49,106.68 110.49,35.56 v109.22,34.29
  Bottom 0.254: R1.1 111.76,107.95 v110.49,106.68 | v109.22,34.29 103.82,34.29 102.87,33.34 100.65,33.34 99.06,34.92 66.36,34.92 65.09,36.2 61.91,36.2 61.28,35.56 U6.2 U6.1 40.64,34.29 37.78,31.43 32.07,31.43 28.57,27.94 26.67,26.04 5.4,26.04 1.75,29.69 | 1.75,29.69 1.59,29.84 | R52.1 1.27,30.16 1.75,29.69
N$309  (via drill 0.6)
  Top 0.254: v92.71,81.92 92.71,46.35 91.12,44.77 91.12,40.96 v91.44,40.64
  Bottom 0.254: v91.44,40.64 90.81,41.27 83.5,41.27 82.23,42.55 62.23,42.55 61.59,41.91 U6.7 U6.6 57.15,40.64 28.89,40.64 26.99,42.55 13.34,42.55 12.6,43.28 R51.1 | R17.1 110.81,87.63 108.27,85.09 108.27,83.82 107.31,82.87 106.05,82.87 105.09,83.82 98.42,83.82 97.47,82.87 93.66,82.87 v92.71,81.92
N$310  (via drill 0.5, 0.6)
  Top 0.254: v89.85,40.01 89.85,45.09 v90.81,46.04 | v60.64,43.18 60.64,42.23 60.64,41.91 v61.59,40.96
  Bottom 0.254: U6.9 U6.8 | R21.1 112.08,84.77 112.08,83.5 114.3,81.28 114.3,67.31 115.57,66.04 118.11,66.04 119.38,64.77 119.38,43.18 118.11,41.91 102.87,41.91 101.6,43.18 100.33,43.18 99.06,41.91 95.57,41.91 91.44,46.04 v90.81,46.04 | U6.8 80.96,41.91 84.45,38.42 88.27,38.42 v89.85,40.01 | R49.1 23.81,44.77 24.77,43.81 27.62,43.81 28.26,43.18 29.53,43.18 30.48,44.13 33.34,44.13 35.56,41.91 54.61,41.91 55.88,43.18 v60.64,43.18 | U6.8 62.87,41.91 62.55,41.91 v61.59,40.96
N$311  (via drill 0.5, 0.6)
  Top 0.254: v81.6,33.02 v81.6,64.77 | v31.75,41.91 31.75,31.75 v33.02,30.48
  Bottom 0.254: v81.6,33.02 80.33,34.29 66.04,34.29 64.77,35.56 U6.13 U6.14 62.29,33.02 40.64,33.02 38.1,30.48 v33.02,30.48 | v81.6,64.77 83.98,64.77 85.88,66.67 89.22,66.67 91.12,64.77 94.93,64.77 95.89,65.72 97.16,65.72 98.11,64.77 105.09,64.77 106.05,65.72 109.86,65.72 112.08,63.5 R43.1 | R50.1 v31.75,41.91
N$312  (via drill 0.5, 0.6)
  Top 0.254: v109.22,60.96 109.22,59.69 109.86,59.05 109.86,36.83 106.68,33.66 104.14,33.66 v102.87,32.38 | v60.96,25.4 60.96,6.99 v60.33,6.35 | v43.18,43.18 43.18,7.3 43.18,6.99 v42.23,6.03
  Bottom 0.254: U9.2 U9.1 | R45.1 v109.22,60.96 | v102.87,32.38 100.65,32.38 98.9,30.64 98.9,23.65 97.47,22.23 84.3,22.23 81.76,24.77 75.56,24.77 61.59,24.77 v60.96,25.4 | v60.33,6.35 U9.2 | R54.1 42.97,42.97 v43.18,43.18 | v42.23,6.03 56.83,6.03 57.15,6.35 U9.2
N$313  (via drill 0.5)
  Top 0.254: v56.52,12.7 58.42,14.61 v58.42,22.86 55.88,25.4 55.88,34.29 54.29,35.88 v54.29,43.5
  Bottom 0.254: U9.6 U9.7 v56.52,12.7 | R57.1 111.76,39.37 110.49,38.1 110.49,20.32 110.49,20 109.22,18.73 107.95,18.73 107.63,18.41 85.09,18.41 84.77,18.73 84.14,18.73 82.87,20 82.55,20.32 78.74,24.13 59.69,24.13 v58.42,22.86 | R53.1 53.76,42.97 v54.29,43.5
N$314  (via drill 0.5)
  Top 0.254: v76.83,22.86 76.83,22.23 76.2,21.59 76.2,12.7 v74.93,11.43 | v66.04,44.45 66.04,41.91 68.58,39.37 68.58,22.86 v69.22,22.23
  Bottom 0.254: U9.9 U9.8 73.66,12.7 v74.93,11.43 | R61.1 112.08,36.83 112.08,34.61 112.08,20.64 112.08,20.32 109.86,18.1 108.27,18.1 107.95,17.78 84.77,17.78 84.45,18.1 82.55,18.1 78.74,21.91 77.79,22.86 v76.83,22.86 76.2,22.86 75.56,22.23 v69.22,22.23 | R48.1 65.72,44.77 v66.04,44.45
N$315  (via drill 0.5)
  Top 0.254: v69.85,5.08 71.12,6.35 v71.12,20.32 73.66,22.86 73.66,34.92 76.2,37.47 v76.2,44.45
  Bottom 0.254: U9.13 U9.14 v69.85,5.08 | R76.1 111.76,15.24 109.54,17.46 109.22,17.46 108.58,17.46 108.27,17.14 84.45,17.14 84.14,17.46 81.6,17.46 80.01,19.05 80.01,19.37 77.79,21.59 72.39,21.59 v71.12,20.32 | R47.1 75.88,44.77 v76.2,44.45
S0  (via drill 0.5)
  Top 0.254: v35.88,52.7 35.88,52.07 36.2,51.75 36.2,51.12 35.88,50.8 35.88,35.24 39.37,31.75 v39.37,27.3
  Bottom 0.254: U5.10 10.79,52.7 11.43,52.07 34.29,52.07 34.92,52.7 v35.88,52.7 | v39.37,27.3 43.81,27.3 44.13,27.62 63.5,27.62 63.82,27.62 TENSY3.2.8
S1  (via drill 0.5)
  Top 0.254: v35.24,51.44 35.24,34.92 38.42,31.75 v38.42,28.26
  Bottom 0.254: U5.11 9.53,52.7 10.79,51.44 v35.24,51.44 | v38.42,28.26 61.91,28.26 TENSY3.2.7
S2  (via drill 0.6)
  Top 0.254: v60.96,53.34 60.96,48.26 59.69,46.99 59.69,38.1 60.96,36.83 62.23,35.56 TENSY3.2.6
  Bottom 0.254: U5.14 9.53,59.69 10.79,58.42 27.62,58.42 27.94,58.74 30.16,58.74 30.48,58.42 39.05,58.42 43.5,53.98 51.44,53.98 52.07,54.61 53.98,54.61 55.24,53.34 v60.96,53.34
S3  (via drill 0.6)
  Top 0.254: TENSY3.2.5 59.69,36.83 55.88,40.64 55.88,51.75 53.98,53.66 v53.66,53.66
  Bottom 0.254: U5.13 8.26,59.05 9.53,57.78 27.62,57.78 27.94,57.78 28.26,58.1 29.84,58.1 30.16,57.78 38.73,57.78 43.18,53.34 53.02,53.34 53.34,53.34 v53.66,53.66
S$17  (via drill 3.2)
  other vias: 87.63,6.99
SCL  (via drill 0.5)
  Top 0.254: v7.62,21.59 7.62,42.23 5.4,44.45 5.4,52.7 6.35,53.66 6.35,72.39 5.4,73.34 5.4,77.79 6.35,78.74 6.67,79.06 6.67,89.85 5.08,91.44 5.08,95.89 6.99,97.79 6.99,99.06 J1.P2 | v82.87,9.84 84.45,9.84 86.68,12.06 108.9,12.06 110.81,10.16 110.81,8.89 112.08,7.62 111.76,7.62 JP3.2
  Bottom 0.254: v7.62,21.59 8.26,22.23 20.64,22.23 21.59,21.27 28.26,21.27 30.48,19.05 60.96,19.05 62.23,17.78 TENSY3.2.19/A5 62.23,15.24 63.5,13.97 65.41,13.97 66.04,13.34 78.11,13.34 81.6,9.84 v82.87,9.84 | D3.C 11.12,100.97 D6.A 7.62,98.42 J1.P2
SDA  (via drill 0.5)
  Top 0.254: v6.67,22.54 5.08,24.13 5.08,30.48 6.35,31.75 6.35,36.2 4.76,37.78 4.76,51.44 4.76,53.02 5.71,53.98 5.71,72.07 4.76,73.03 4.76,78.11 5.71,79.06 6.03,79.38 6.03,88.58 2.54,92.08 2.54,106.05 J1.P3 | v82.55,11.75 82.87,11.43 83.82,11.43 85.09,12.7 110.49,12.7 JP3.3
  Bottom 0.254: v6.67,22.54 6.99,22.86 20.95,22.86 21.91,21.91 28.57,21.91 30.8,19.68 62.87,19.68 64.77,17.78 TENSY3.2.18/A4 66.67,13.97 80.01,13.97 80.33,13.97 v82.55,11.75 | J1.P3 6.04,108.58 D1.A 9.2,106.05 D2.C
VCC  (via drill 0.5, 0.6)
  Top 0.406: v78.74,87.63 78.74,86.36 80.01,85.09 v80.01,80.64 v80.01,71.12 80.01,58.42 80.64,57.78 80.64,56.52 80.64,34.92 80.01,34.29 v80.01,3.81 | v53.34,3.81 53.34,8.26 v53.98,8.89 | v9.84,73.66 v9.84,69.85 | v24.77,61.59 24.77,65.41 23.5,66.67 23.5,70.48 24.77,71.75 24.77,74.61 v24.13,75.25 | v45.09,61.28 45.09,59.05 46.04,58.1 46.04,40.32 v48.26,38.1
  Bottom 0.406: D4.C 76.19,87.78 C3.+ | U6.4 55.88,38.1 55.66,38.31 C16.1 54.08,38.1 v48.26,38.1 | C20.1 v53.98,8.89 U9.4 | v80.01,3.81 v53.34,3.81 | U3.4 v9.84,69.85 C11.1 | v78.74,87.63 C3.+ | C3.+ 74.93,87.63 | 74.93,87.63 74.3,87 72.07,87 71.75,87 70.48,87 66.99,87 63.82,83.82 39.37,83.82 33.66,78.11 29.84,78.11 26.99,75.25 v24.13,75.25 13.02,75.25 12.7,75.56 10.79,75.56 9.84,74.61 v9.84,73.66 | 74.93,87.63 C3.+ | C14.1 45.3,60.11 | 44.45,60.96 39.05,60.96 38.73,61.28 25.08,61.28 v24.77,61.59 | C14.1 U4.4 | IC3.3 75.86,80.3 75.88,80.33 76.35,80.94 C6.+ 76.83,80.64 77.15,80.96 77.47,80.64 v80.01,80.64 80.01,81.28 80.01,81.92 80.33,82.23 87.95,82.23 88.9,82.23 90.81,80.33 93.56,80.33 C23.1 93.66,80.96 94.93,82.23 97.47,82.23 98.74,80.96 98.74,79.69 99.69,78.74 102.55,78.74 102.87,78.42 103.91,77.38 IC4.1 | 44.45,60.96 44.77,60.96 v45.09,61.28 | C14.1 45.3,60.11 | 45.3,60.11 44.45,60.96
VEE  (via drill 0.5)
  Top 0.406: v59.37,86.04 59.37,78.74 | 59.37,78.74 59.37,63.18 v59.37,57.78 60.01,57.15 61.91,55.24 61.91,49.53 63.5,47.94 63.5,42.86 v66.67,39.69 66.04,39.05 66.04,21.59 68.58,19.05 v68.58,10.16 | v20.32,69.85 v20.32,76.2 | v77.47,96.52 72.71,96.52 v72.39,96.84 | v71.75,88.11 71.75,80.17 69.53,77.95 v67.94,77.95 | v63.02,77.95 60.17,77.95 59.37,78.74
  Bottom 0.406: D5.A 58.42,99.06 59.69,97.79 59.69,87.77 C4.- | U4.11 56.83,59.69 C13.1 58.84,58.95 59.37,58.42 v59.37,57.78 | C4.- 59.55,87.77 | C4.- 59.55,86.22 v59.37,86.04 58.1,84.77 39.05,84.77 38.73,84.45 33.34,79.06 29.53,79.06 29.21,78.74 26.67,76.2 v20.32,76.2 | U6.11 C15.1 67.63,38.2 67.63,38.73 v66.67,39.69 | C10.1 v20.32,69.85 U3.11 | v68.58,10.16 67.73,9.31 C19.1 U9.11 | R6.1 78,95.99 v77.47,96.52 | v72.39,96.84 70.7,96.84 R5.1 70.48,94.61 71.12,93.98 71.12,88.74 v71.75,88.11 | v67.94,77.95 v63.02,77.95
W0  (via drill 0.5)
  Top 0.254: v2.54,81.28 v2.54,69.85 2.54,53.34 3.02,52.86 3.02,50.01 3.17,49.85 TM1.WIPER
  Bottom 0.254: R26.1 3.81,82.55 v2.54,81.28 | U3.3 3.81,68.58 v2.54,69.85
W1  (via drill 0.5)
  Top 0.254: v3.81,87.63 v3.81,72.39 3.49,72.07 3.49,53.98 v3.81,53.66
  Bottom 0.254: U3.5 5.08,71.12 v3.81,72.39 | v3.81,87.63 3.81,87.31 3.81,87 5.71,85.09 R24.1 | v3.81,53.66 6.03,51.44 7.94,51.44 8.89,50.48 8.89,49.53 9.53,48.9 11.75,48.9 12.38,48.9 13.34,49.85 13.27,49.85 TM2.WIPER
W2  (via drill 0.5)
  Top 0.254: v26.35,85.09 v26.35,72.07 26.35,71.75 26.35,68.9 26.35,54.29 26.35,53.02 23.5,50.16 23.59,50.07 TM3.WIPER
  Bottom 0.254: U3.10 25.72,71.12 26.35,71.75 v26.35,72.07 | v26.35,85.09 R23.1
W3  (via drill 0.5)
  Top 0.254: v27.94,69.85 v27.94,81.28 | TM4.WIPER 33.75,50.07 33.66,50.16 33.66,51.75 36.83,54.93 36.83,57.15 36.83,68.26 v35.24,69.85
  Bottom 0.254: U3.12 26.67,68.58 v27.94,69.85 v35.24,69.85 | v27.94,81.28 26.67,82.55 R25.1
W4  (via drill 0.5)
  Top 0.254: v41.91,58.74 v41.91,69.85 | TM5.WIPER 43.81,50.16 44.45,50.8 v44.45,57.78
  Bottom 0.254: U4.3 47.31,58.42 46.67,57.78 v44.45,57.78 42.86,57.78 v41.91,58.74 | v41.91,69.85 41.91,70.17 42.86,71.12 R38.1
W5  (via drill 0.5)
  Top 0.254: v36.83,73.66 36.83,69.85 38.1,68.58 v38.1,62.23 v38.1,53.34
  Bottom 0.254: R36.1 38.73,73.66 v36.83,73.66 | v38.1,62.23 46.99,62.23 48.26,60.96 U4.5 | TM6.WIPER 53.98,50.16 53.75,50.39 53.75,51.34 53.02,52.07 39.37,52.07 v38.1,53.34
W6  (via drill 0.5)
  Top 0.254: v63.18,72.71 v63.18,60.33 63.18,60.01 63.5,59.69 63.82,59.37 63.82,50.23 TM7.WIPER
  Bottom 0.254: v63.18,60.33 62.87,60.33 62.23,60.96 U4.10 | R35.1 62.23,73.66 v63.18,72.71
W7  (via drill 0.5)
  Top 0.254: v62.23,59.37 v62.23,69.85 | TM8.WIPER 74.39,50.39 74.3,50.16 v74.3,58.1
  Bottom 0.254: U4.12 56.52,58.42 59.05,55.88 60.96,55.88 62.23,57.15 62.23,58.42 v62.23,59.37 62.55,59.37 66.99,59.37 68.26,58.1 v74.3,58.1 | v62.23,69.85 62.23,70.17 61.28,71.12 R37.1
W8  (via drill 0.5)
  Top 0.254: TM9.WIPER 3.81,2.54 3.81,6.03 3.17,6.67 3.17,6.99 v3.17,26.67 3.17,31.11 v4.13,32.07 | v29.21,34.29 v29.21,26.67
  Bottom 0.254: v4.13,32.07 5.08,33.02 R66.1 | U6.3 56.52,36.83 55.24,35.56 31.75,35.56 30.48,35.56 v29.21,34.29 | v29.21,26.67 27.94,25.4 4.45,25.4 v3.17,26.67
W9  (via drill 0.5)
  Top 0.254: v2.54,5.71 2.54,25.4 2.22,25.72 2.22,27.3 2.54,27.62 2.54,27.94 v2.54,36.2 v2.54,40.64
  Bottom 0.254: R64.1 5.08,35.56 4.45,36.2 v2.54,36.2 | v2.54,5.71 2.54,5.08 3.49,4.13 4.45,4.13 11.75,4.13 13.02,2.86 13.34,2.54 13.34,2.16 TM10.WIPER | U6.5 26.67,39.37 24.13,41.91 3.81,41.91 v2.54,40.64
W10  (via drill 0.5)
  Top 0.254: TM11.WIPER 23.5,1.91 27.4,5.81 27.4,33.88 v27.3,33.97 27.62,34.29 v27.62,40.32
  Bottom 0.254: v27.3,33.97 27.3,34.29 26.04,35.56 R63.1 | U6.10 62.23,39.37 61.59,40.01 28.57,40.01 28.26,40.32 v27.62,40.32
W11  (via drill 0.5)
  Top 0.254: TM12.WIPER 33.56,27.21 35.56,29.21 v35.56,33.02 | v35.56,33.02 35.66,32.92 v35.56,33.02
  Bottom 0.254: R65.1 24.13,33.02 v35.56,33.02 37.47,34.92 55.56,34.92 56.83,36.2 60.96,36.2 61.59,36.83 U6.12
W12  (via drill 0.5)
  Top 0.254: TM13.WIPER 43.59,2 43.91,2 43.5,1.91 v48.58,6.99 | v5.08,6.35 v5.08,12.38
  Bottom 0.254: U9.3 56.83,7.62 56.2,6.99 v48.58,6.99 30.48,6.99 30.16,6.99 28.57,5.4 27.94,5.4 6.03,5.4 v5.08,6.35 | R80.1 5.4,12.7 v5.08,12.38
W13  (via drill 0.5)
  Top 0.254: TM14.WIPER 54.07,1.81 53.98,1.91 55.24,3.17 v55.24,11.11 | v26.35,16.51 26.35,22.23 25.72,22.86 v25.08,22.86 | v4.45,22.23 3.81,21.59 3.81,16.51 v4.45,15.88
  Bottom 0.254: U9.5 57.15,10.16 56.2,11.11 v55.24,11.11 43.18,11.11 40.96,13.34 29.53,13.34 v26.35,16.51 | v25.08,22.86 24.77,22.54 22.23,22.54 21.27,23.5 5.71,23.5 v4.45,22.23 | v4.45,15.88 5.08,15.24 R78.1
W14  (via drill 0.5)
  Top 0.254: TM15.WIPER 64.23,1.81 64.14,1.91 67.31,5.08 v67.31,10.79
  Bottom 0.254: v67.31,10.79 66.67,10.79 66.04,10.16 U9.10 62.23,10.16 61.59,9.53 56.83,9.53 56.2,10.16 43.18,10.16 40.64,12.7 29.21,12.7 26.35,15.56 R75.1
W15  (via drill 0.5)
  Top 0.254: TM16.WIPER 74.39,1.81 74.3,1.91 77.15,4.76 v77.15,6.99
  Bottom 0.254: v77.15,6.99 66.67,6.99 66.04,7.62 U9.12 60.64,7.62 60.01,8.26 56.52,8.26 55.88,7.62 49.53,7.62 49.21,7.94 47.94,7.94 47.62,7.62 44.77,7.62 40.32,12.06 28.89,12.06 28.26,12.7 R79.1

## Text on the board
bNames: Korg, Makenoise | Mangu Díaz 2019 | K | Arturia, Novation | A | Tip is Out / Ring is +5V | K | Tip is +5V / Ring is Out | A | Sweet Sixteen | PSU | REG | 16 | Sean Hellfritsch / Brian Crabtree / Tom Armitage / Brendon Cassidy | I2C: Tip SDA, Ring SCL / DO NOT HOT PLUG | Teensy 3.2 | Creative Commons / Attribution / ShareAlike | CC-BY-SA 4.0 | SDA | SCL | GND | I2C